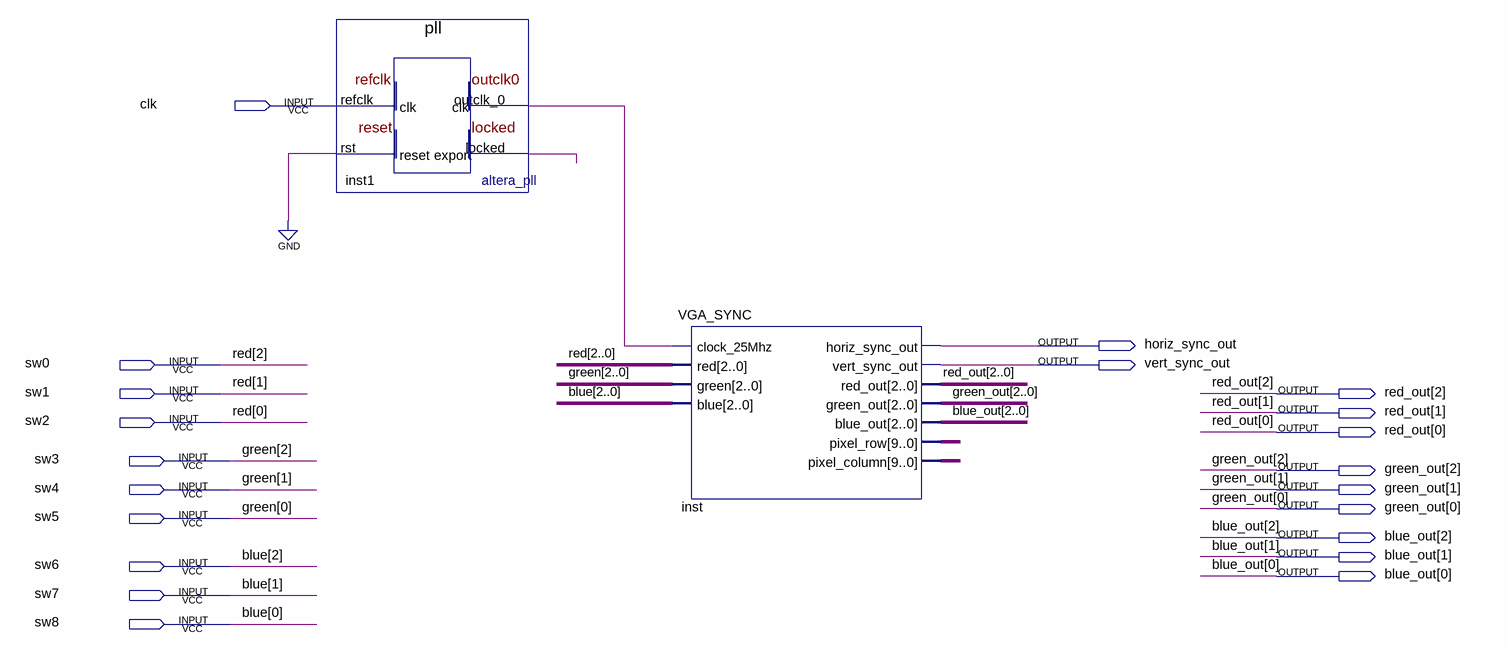
[diagram p0: schematic sheet]
// Quartus schematic vga_3bit_color.bdf as structural Verilog: 2 symbols, 21 pins
module vga_3bit_color (
  input  clk,
  input  sw0,
  input  sw1,
  input  sw2,
  input  sw3,
  input  sw4,
  input  sw5,
  input  sw6,
  input  sw7,
  input  sw8,
  output horiz_sync_out,
  output vert_sync_out,
  output [2:0] red_out,
  output [2:0] green_out,
  output [2:0] blue_out
);

  wire inst1_locked, inst1_outclk_0;
  wire [9:0] inst_pixel_column, inst_pixel_row;

  pll inst1 (.refclk(clk), .rst(1'b0), .outclk_0(inst1_outclk_0), .locked(inst1_locked));
  VGA_SYNC inst (
    .clock_25Mhz(inst1_outclk_0), .red({sw0, sw1, sw2}), .green({sw3, sw4, sw5}), .blue({sw6, sw7, sw8}),
    .horiz_sync_out(horiz_sync_out), .vert_sync_out(vert_sync_out), .red_out(red_out), .green_out(green_out),
    .blue_out(blue_out), .pixel_row(inst_pixel_row), .pixel_column(inst_pixel_column));

  // Other names for the same wires on the sheet: blue[2:0] = {sw6, sw7, sw8}; green[2:0] = {sw3, sw4, sw5};
  //   red[2:0] = {sw0, sw1, sw2}
endmodule
